# EAGLE design front-panel-module-revB (EAGLE 5.11)
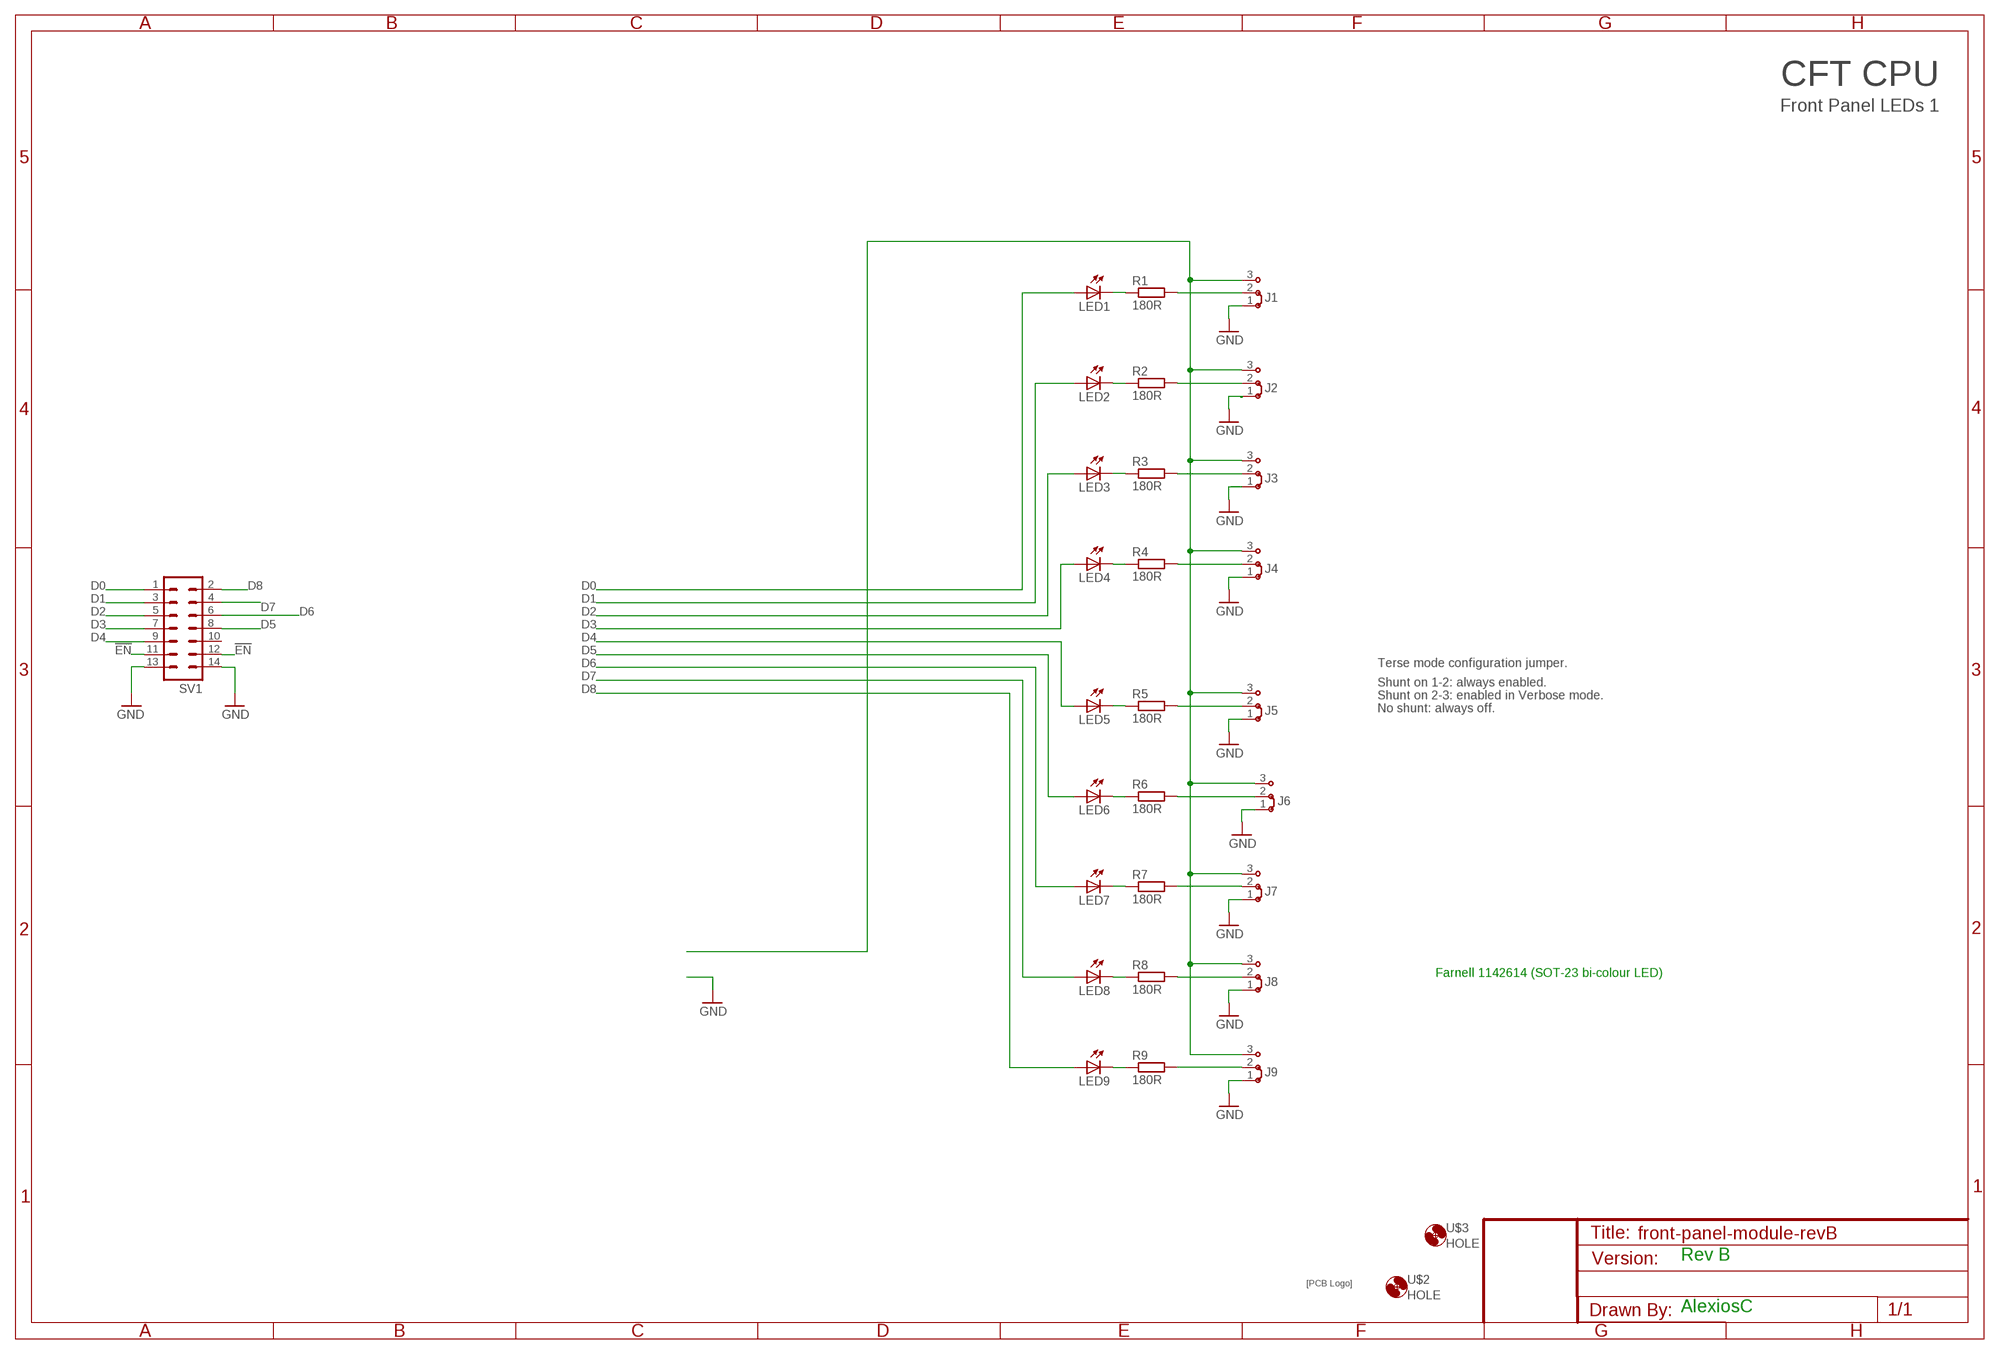
[diagram p0: schematic, sheet 1]

## Parts
J1  J2X5MM  [05C]
J2  J2X5MM  [05C]
J3  J2X5MM  [05C]
J4  J2X5MM  [05C]
J5  J2X5MM  [05C]
J6  J2X5MM  [05C]
J7  J2X5MM  [05C]
J8  J2X5MM  [05C]
J9  J2X5MM  [05C]
LED1  LED-5MM-AMBER  LEDP-LCC-2  [P-LCC-2]
LED2  LED-5MM-AMBER  LEDP-LCC-2  [P-LCC-2]
LED3  LED-5MM-AMBER  LEDP-LCC-2  [P-LCC-2]
LED4  LED-5MM-AMBER  LEDP-LCC-2  [P-LCC-2]
LED5  LED-5MM-AMBER  LEDP-LCC-2  [P-LCC-2]
LED6  LED-5MM-AMBER  LEDP-LCC-2  [P-LCC-2]
LED7  LED-5MM-AMBER  LEDP-LCC-2  [P-LCC-2]
LED8  LED-5MM-AMBER  LEDP-LCC-2  [P-LCC-2]
LED9  LED-5MM-AMBER  LEDP-LCC-2  [P-LCC-2]
R1  180R  R-EU_M0805  [M0805]
R2  180R  R-EU_M0805  [M0805]
R3  180R  R-EU_M0805  [M0805]
R4  180R  R-EU_M0805  [M0805]
R5  180R  R-EU_M0805  [M0805]
R6  180R  R-EU_M0805  [M0805]
R7  180R  R-EU_M0805  [M0805]
R8  180R  R-EU_M0805  [M0805]
R9  180R  R-EU_M0805  [M0805]
SV1  ML14  [ML14]
U$2  HOLE  [STANDOFF_28_60]
U$3  HOLE  [STANDOFF_28_60]
U$6  SIGNATURESILK  [SIGNATURE]

## Nets
!EN: J1.3 J2.3 J3.3 J4.3 J5.3 J6.3 J7.3 J8.3 J9.3 SV1.11 SV1.12
D0: LED1.A SV1.1
D1: LED2.A SV1.3
D2: LED3.A SV1.5
D3: LED4.A SV1.7
D4: LED5.A SV1.9
D5: LED6.A SV1.8
D6: LED7.A SV1.6
D7: LED8.A SV1.4
D8: LED9.A SV1.2
GND: J1.1 J2.1 J3.1 J4.1 J5.1 J6.1 J7.1 J8.1 J9.1 SV1.13 SV1.14
N$3: LED1.C R1.1
N$4: J1.2 R1.2
N$5: J2.2 R2.2
N$6: J3.2 R3.2
N$7: J4.2 R4.2
N$8: J5.2 R5.2
N$9: J6.2 R6.2
N$10: J7.2 R7.2
N$11: J8.2 R8.2
N$12: LED9.C R9.1
N$13: J9.2 R9.2
N$110: LED2.C R2.1
N$111: LED3.C R3.1
N$114: LED4.C R4.1
N$115: LED5.C R5.1
N$116: LED6.C R6.1
N$117: LED7.C R7.1
N$118: LED8.C R8.1
Unconnected: SV1.10

## Notes on the sheet
- CFT CPU
- Front Panel LEDs 1
- Terse mode configuration jumper.
- Shunt on 1-2: always enabled.
- Shunt on 2-3: enabled in Verbose mode.
- No shunt: always off.
- Farnell 1142614 (SOT-23 bi-colour LED)
- Rev B
- AlexiosC

## Library data of the parts
J1-J9 = jumper:J2: Jumper switch 2 x 2.5 mm
LED1-LED9 = led:LED: LED OSRAM: - CHIPLED LG R971, LG N971, LY N971, LG Q971, LY Q971, LO R971, LY R971 LH N974, LH R974 LS Q976, LO Q976, LY Q976 LO Q996 - Hyper CHIPLED LW Q18S LB Q993, LB Q99A, LB R99A - SideLED LS A670, LO A670, LY A670, LG A670, LP A670 LB A673, LV A673, LT A673, LW A673 LH A674 LY A675 LS A676, LA A676, LO A676, LY A676, LW A676 LS A679, LY A679, LG A679 - Hyper Micro SIDELED® LS Y876, LA Y876, LO Y876, LY Y876 LT Y87S - SmartLED LW L88C, LW L88S LB L89C, LB L89S, LG L890 LS L89K, LO L89K, LY L89K LS L896, LA L896, LO L896, LY L896 - TOPLED LS T670, LO T670, LY T670, LG T670, LP T670 LSG T670, LSP T670, LSY T670, LOP T670, LYG T670 LG T671, LOG T671, LSG T671 LB T673, LV T673, LT T673, LW T673 LH T674 LS T676, LA T676, LO T676, LY T676, LB T676, LH T676, LSB T676, LW T676 LB T67C, LV T67C, LT T67C, LS T67K, LO T67K, LY T67K, LW E67C LS E67B, LA E67B, LO E67B, LY E67B, LB E67C, LV E67C, LT E67C LW T67C LS T679, LY T679, LG T679 LS T770, LO T770, LY T770, LG T770, LP T770 LB T773, LV T773, LT T773, LW T773 LH T774 LS E675, LA E675, LY E675, LS T675 LS T776, LA T776, LO T776, LY T776, LB T776 LHGB T686 LT T68C, LB T68C - Hyper Mini TOPLED® LB M676 - Mini TOPLED Santana® LG M470 LS M47K, LO M47K, LY M47K Source: http://www.osram.convergy.de LUXEON: - LUMILED® LXK2-PW12-R00, LXK2-PW12-S00, LXK2-PW14-U00, LXK2-PW14-V00 LXK2-PM12-R00, LXK2-PM12-S00, LXK2-PM14-U00 LXK2-PE12-Q00, LXK2-PE12-R00, LXK2-PE12-S00, LXK2-PE14-T00, LXK2-PE14-U00 LXK2-PB12-K00, LXK2-PB12-L00, LXK2-PB12-M00, LXK2-PB14-N00, LXK2-PB14-P00, LXK2-PB14-Q00 LXK2-PR12-L00, LXK2-PR12-M00, LXK2-PR14-Q00, LXK2-PR14-R00 LXK2-PD12-Q00, LXK2-PD12-R00, LXK2-PD12-S00 LXK2-PH12-R00, LXK2-PH12-S00 LXK2-PL12-P00, LXK2-PL12-Q00, LXK2-PL12-R00 Source: www.luxeon.com KINGBRIGHT: KA-3528ASYC Source: www.kingbright.com
R1-R9 = resistor:R-EU_: RESISTOR, European symbol
SV1 = con-ml:ML14: HARTING; OC_FARNELL: unknown; OC_NEWARK: unknown
U$2 U$3 = alexios:HOLE: Hole for a standoff or mount. Hole diameter: 3.3mm. External Diameter: 6mm.
U$6 = alexios:SIGNATURE: Soup signature

## Net classes
0 default: width 0.305 mm, clearance 0.254 mm

## Board
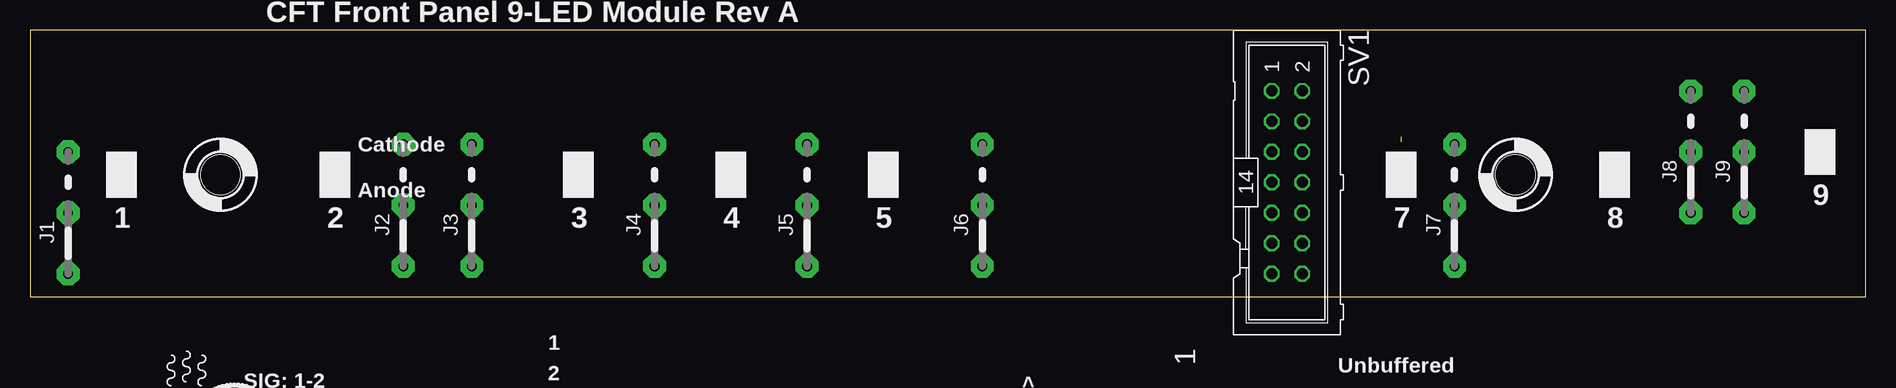
[diagram p1: board, top side]
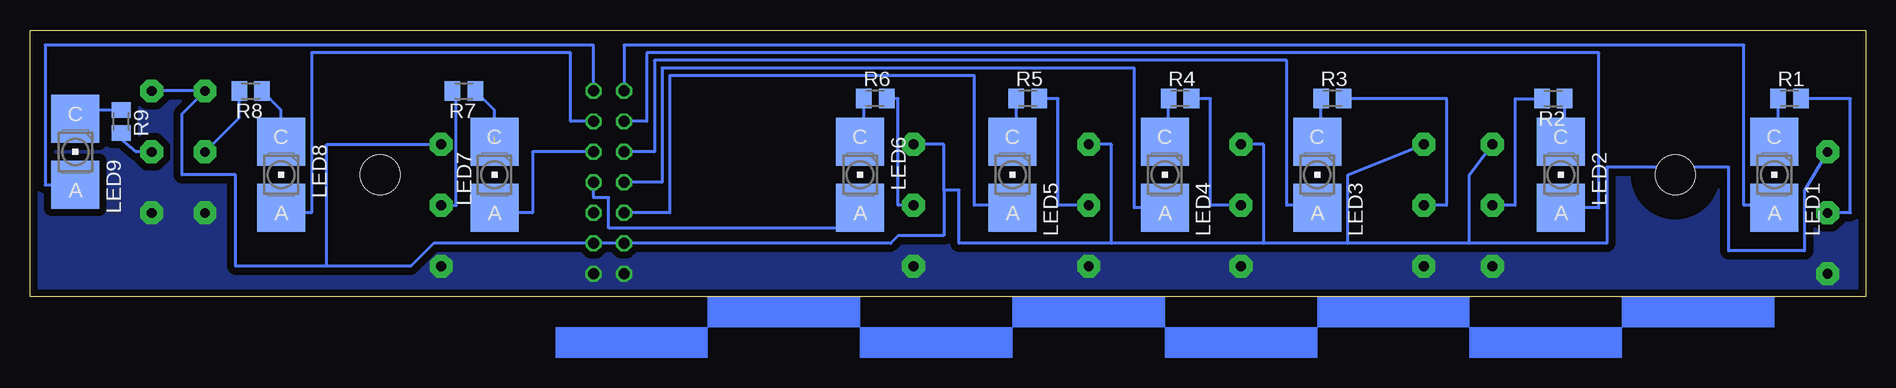
[diagram p2: board, bottom side, seen from below]

Size 153.01 x 22.23 mm. Coordinates in mm from the lower left corner, seen from the top.
Outline: 0,0 153.01,0 153.01,22.23 0,22.23 0,0
Copper layers (1*16): Top 0.035mm / dielectric 0.2mm / Bottom 0.035mm
Design rules "MyroPCB-8mil-prototyping": minimum track width 8mil, minimum drill 12mil, track to track 8mil, track to pad 8mil, pad to pad 8mil, via to via 8mil, smd to smd 8mil, copper to edge 20mil, drill to drill 8mil, minimum pad ring 8mil, minimum via ring 8mil, stop-mask expansion 4mil, vias tented up to drill 0mil, thermal gap 8mil

### Footprints (pad centres in the part's own frame; a part is rotated, then mirrored left to right if it is on the bottom)
05C = drill 0.813 pad 1.905 octagon: 1 -2.54,0; 2 2.54,0; 3 7.62,0
P-LCC-2 = smd 4 x 4: A 0,2.75; C 0,-2.75
M0805 = smd 1.3 x 1.6: 1 -0.95,0; 2 0.95,0
ML14 = drill 0.914 octagon: 1 -7.62,-1.27; 2 -7.62,1.27; 3 -5.08,-1.27; 4 -5.08,1.27; 5 -2.54,-1.27; 6 -2.54,1.27; 7 0,-1.27; 8 0,1.27; 9 2.54,-1.27; 10 2.54,1.27; 11 5.08,-1.27; 12 5.08,1.27; 13 7.62,-1.27; 14 7.62,1.27
STANDOFF_28_60 = hole 3.302: 0,0

### Placement (x,y rotation side)
J1  3.17,4.45 90 top
J2  31.11,5.08 90 top
J3  36.83,5.08 90 top
J4  52.07,5.08 90 top
J5  64.77,5.08 90 top
J6  79.38,5.08 90 top
J7  118.75,5.08 90 top
J8  138.43,9.53 90 top
J9  142.88,9.53 90 top
LED1  7.62,10.16 180 bottom
LED2  25.4,10.16 180 bottom
LED3  45.72,10.16 180 bottom
LED4  58.42,10.16 180 bottom
LED5  71.12,10.16 180 bottom
LED6  83.82,10.16 180 bottom
LED7  114.3,10.16 180 bottom
LED8  132.08,10.16 180 bottom
LED9  149.22,12.06 180 bottom
R1  6.35,16.51 0 bottom
R2  26.04,16.51 180 bottom
R3  44.45,16.51 0 bottom
R4  57.15,16.51 0 bottom
R5  69.85,16.51 0 bottom
R6  82.55,16.51 0 bottom
R7  116.84,17.14 180 bottom
R8  134.62,17.14 180 bottom
R9  145.41,14.61 270 bottom
SV1  104.78,9.53 270 top
U$2  123.83,10.16 0 top
U$3  15.88,10.16 0 top
U$6  10.16,-12.7 0 top  (outside the outline)

### Tracks (layer width: path | path; a pad name or v marks a point on that pad's centre or on a via)
!EN
  Bottom 0.254: J1.3 5.08,8.89 5.08,3.81 11.43,3.81 11.43,10.79 21.59,10.79 21.59,4.45 33.02,4.45 | J2.3 33.02,10.16 33.02,4.45 | J3.3 43.18,10.16 43.18,4.45 | 43.18,4.45 50.16,4.45 | J4.3 50.16,12.7 50.16,4.45 | 76.83,8.89 75.56,8.89 75.56,4.45 62.87,4.45 | 76.83,8.89 76.83,12.7 J6.3 | J9.3 J8.3 140.34,15.24 140.34,10.16 135.89,10.16 135.89,2.54 128.27,2.54 | 76.83,8.89 76.83,5.08 80.64,5.08 81.28,4.45 SV1.11 SV1.12 119.38,4.45 121.28,2.54 128.27,2.54 | 50.16,4.45 62.87,4.45 | 62.87,4.45 62.87,12.7 J5.3 | 33.02,4.45 43.18,4.45 | 128.27,2.54 128.27,12.7 J7.3
D0
  Bottom 0.254: SV1.1 103.5,20.95 10.16,20.95 10.16,7.62 7.62,7.62 LED1.A
D1
  Bottom 0.254: LED2.A 22.23,7.41 22.23,20.32 101.6,20.32 101.6,14.61 SV1.3
D2
  Bottom 0.254: SV1.5 100.97,12.06 100.97,19.68 48.26,19.68 48.26,7.62 45.72,7.62 LED3.A
D3
  Bottom 0.254: LED4.A 60.96,7.41 60.96,19.05 100.33,19.05 100.33,9.53 SV1.7
D4
  Bottom 0.254: SV1.9 99.69,6.99 99.69,18.41 74.3,18.41 74.3,7.62 71.12,7.62 LED5.A
D5
  Bottom 0.254: SV1.8 106.05,8.26 104.78,8.26 104.78,5.71 83.82,5.71 LED6.A
D6
  Bottom 0.254: SV1.6 111.12,12.06 111.12,6.99 114.3,6.99 LED7.A
D7
  Bottom 0.254: SV1.4 107.95,14.61 107.95,20.32 129.54,20.32 129.54,6.99 132.08,6.99 LED8.A
D8
  Bottom 0.254: SV1.2 106.05,20.95 151.76,20.95 151.76,9.31 LED9.A
GND
  pour Bottom (isolate 0.61, rank 6, no thermals): 0,0 0,22.23 153.03,22.23 152.4,0
N$3
  Bottom 0.254: R1.1 7.3,13.23 LED1.C
N$4
  Bottom 0.254: R1.2 1.27,16.51 1.27,6.99 J1.2
N$5
  Bottom 0.254: J2.2 29.21,7.62 29.21,16.51 R2.2
N$6
  Bottom 0.254: J3.2 34.92,7.62 34.92,16.51 R3.2
N$7
  Bottom 0.254: R4.2 54.61,16.51 54.61,7.62 J4.2
N$8
  Bottom 0.254: R5.2 67.31,16.51 67.31,7.62 J5.2
N$9
  Bottom 0.254: R6.2 80.64,16.51 80.64,7.62 J6.2
N$10
  Bottom 0.254: R7.2 117.47,17.14 117.47,7.62 J7.2
N$11
  Bottom 0.254: R8.2 135.57,14.93 J8.2
N$12
  Bottom 0.254: R9.1 148.49,15.55 LED9.C
N$13
  Bottom 0.254: R9.2 146.05,13.65 144.15,12.06 J9.2
N$110
  Bottom 0.254: R2.1 25.08,13.23 LED2.C
N$111
  Bottom 0.254: R3.1 45.4,13.23 LED3.C
N$114
  Bottom 0.254: R4.1 58.1,13.23 LED4.C
N$115
  Bottom 0.254: R5.1 70.8,13.23 LED5.C
N$116
  Bottom 0.254: R6.1 83.5,13.23 LED6.C
N$117  (1 unrouted)
  Bottom 0.254: R7.1 114.3,15.55 114.3,13.34
N$118
  Bottom 0.254: R8.1 132.08,15.55 LED8.C
(copper drawn outside any net)
  shapes: Bottom area x8

### Text on the board
tNames: CFT Front Panel 9-LED Module Rev A | Cathode | Anode | 9 | 1 | 2 | 3 | 4 | 5 | 7 | 8 | 1 | Unbuffered | 1 | 2 | SIG: 1-2 | --> | 3 | 1 | !SIG!: 1-3 & | 6 | 1 | 3 | 1 | 1 | 1 | swap anode | (c) 2012 AlexiosC | 2 | 2 | & cathode. | 3 | 2 | 2 | 2 | 3 | 3 | 3 | +5V | !EN! | GND | 1 | 1 | 2 | 2 | 3 | 3